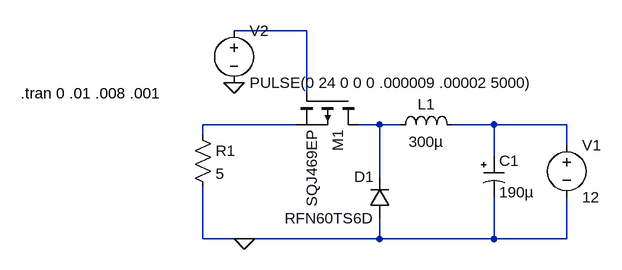
[diagram p0: schematic buck.asc]
buck.asc, the LTspice schematic file:
Version 4
SHEET 1 976 680
WIRE 368 80 256 80
WIRE 368 176 368 80
WIRE 352 224 208 224
WIRE 480 224 448 224
WIRE 512 224 480 224
WIRE 656 224 592 224
WIRE 768 224 656 224
WIRE 208 240 208 224
WIRE 768 256 768 224
WIRE 656 272 656 224
WIRE 480 304 480 224
WIRE 208 400 208 320
WIRE 272 400 208 400
WIRE 480 400 480 368
WIRE 480 400 272 400
WIRE 656 400 656 336
WIRE 656 400 480 400
WIRE 768 400 768 336
WIRE 768 400 656 400
FLAG 272 400 0
FLAG 256 160 0
SYMBOL voltage 768 240 R0
SYMATTR InstName V1
SYMATTR Value 12
SYMBOL pmos 448 176 R90
SYMATTR InstName M1
SYMATTR Value SQJ469EP
SYMBOL ind 496 240 R270
WINDOW 0 32 56 VTop 2
WINDOW 3 5 56 VBottom 2
SYMATTR InstName L1
SYMATTR Value 300µ
SYMATTR SpiceLine Ipk=6.3 Rser=141.9m Rpar=61.23K Cpar=0 mfg="   ---" pn="   ---"
SYMBOL voltage 256 64 R0
SYMATTR InstName V2
SYMATTR Value PULSE(0 24 0 0 0 .000009 .00002 5000)
SYMBOL diode 496 368 R180
WINDOW 0 24 64 Left 2
WINDOW 3 24 0 Left 2
SYMATTR InstName D1
SYMATTR Value RFN60TS6D
SYMBOL res 192 224 R0
SYMATTR InstName R1
SYMATTR Value 5
SYMBOL polcap 640 272 R0
WINDOW 3 24 56 Left 2
SYMATTR Value 190µ
SYMATTR InstName C1
SYMATTR Description Capacitor
SYMATTR Type cap
SYMATTR SpiceLine Rser=60m Lser=0 mfg="   ---" pn="   ---" type="   ---"
TEXT -72 176 Left 2 !.tran 0 .01 .008 .001

The netlist it stands for:
* buck.asc
V1 N004 0 12
M1 N003 N001 N002 N002 SQJ469EP
L1 N003 N004 300µ Ipk=6.3 Rser=141.9m Rpar=61.23K Cpar=0 mfg="   ---" pn="   ---"
V2 N001 0 PULSE(0 24 0 0 0 .000009 .00002 5000)
D1 0 N003 RFN60TS6D
R1 N002 0 5
C1 N004 0 190µ Rser=60m Lser=0 mfg="   ---" pn="   ---" type="   ---"
.model D D
.lib standard.dio
.model NMOS NMOS
.model PMOS PMOS
.lib standard.mos
.tran 0 .01 .008 .001
.backanno
.end